# Altium schematic sheet 04_USB.SchDoc
size A4
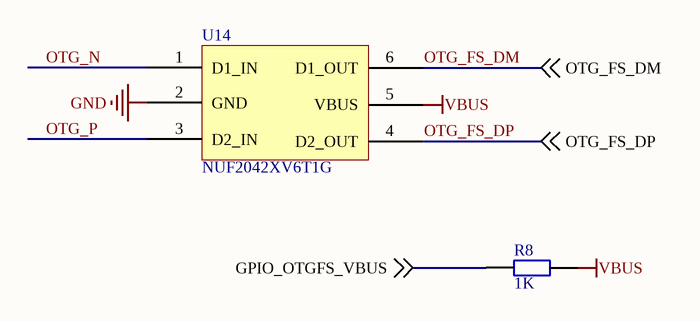
[diagram p0: 04_USB.SchDoc]

## Parts
R8  1K  [0402R]
U14  NUF2042XV6T1G  [SOT563-6]

## Nets
GND: U14.2(GND)
VBUS: R8.2 U14.5(VBUS)
GPIO_OTGFS_VBUS: R8.1 ; off-sheet GPIO_OTGFS_VBUS
OTG_FS_DM: U14.6(D1_OUT) ; off-sheet OTG_FS_DM
OTG_FS_DP: U14.4(D2_OUT) ; off-sheet OTG_FS_DP
OTG_N: U14.1(D1_IN)
OTG_P: U14.3(D2_IN)

## Library data of the parts
R8 = 0402R10K: 0402R10K 1%